# Altium project rovi_tracking.PrjPcb
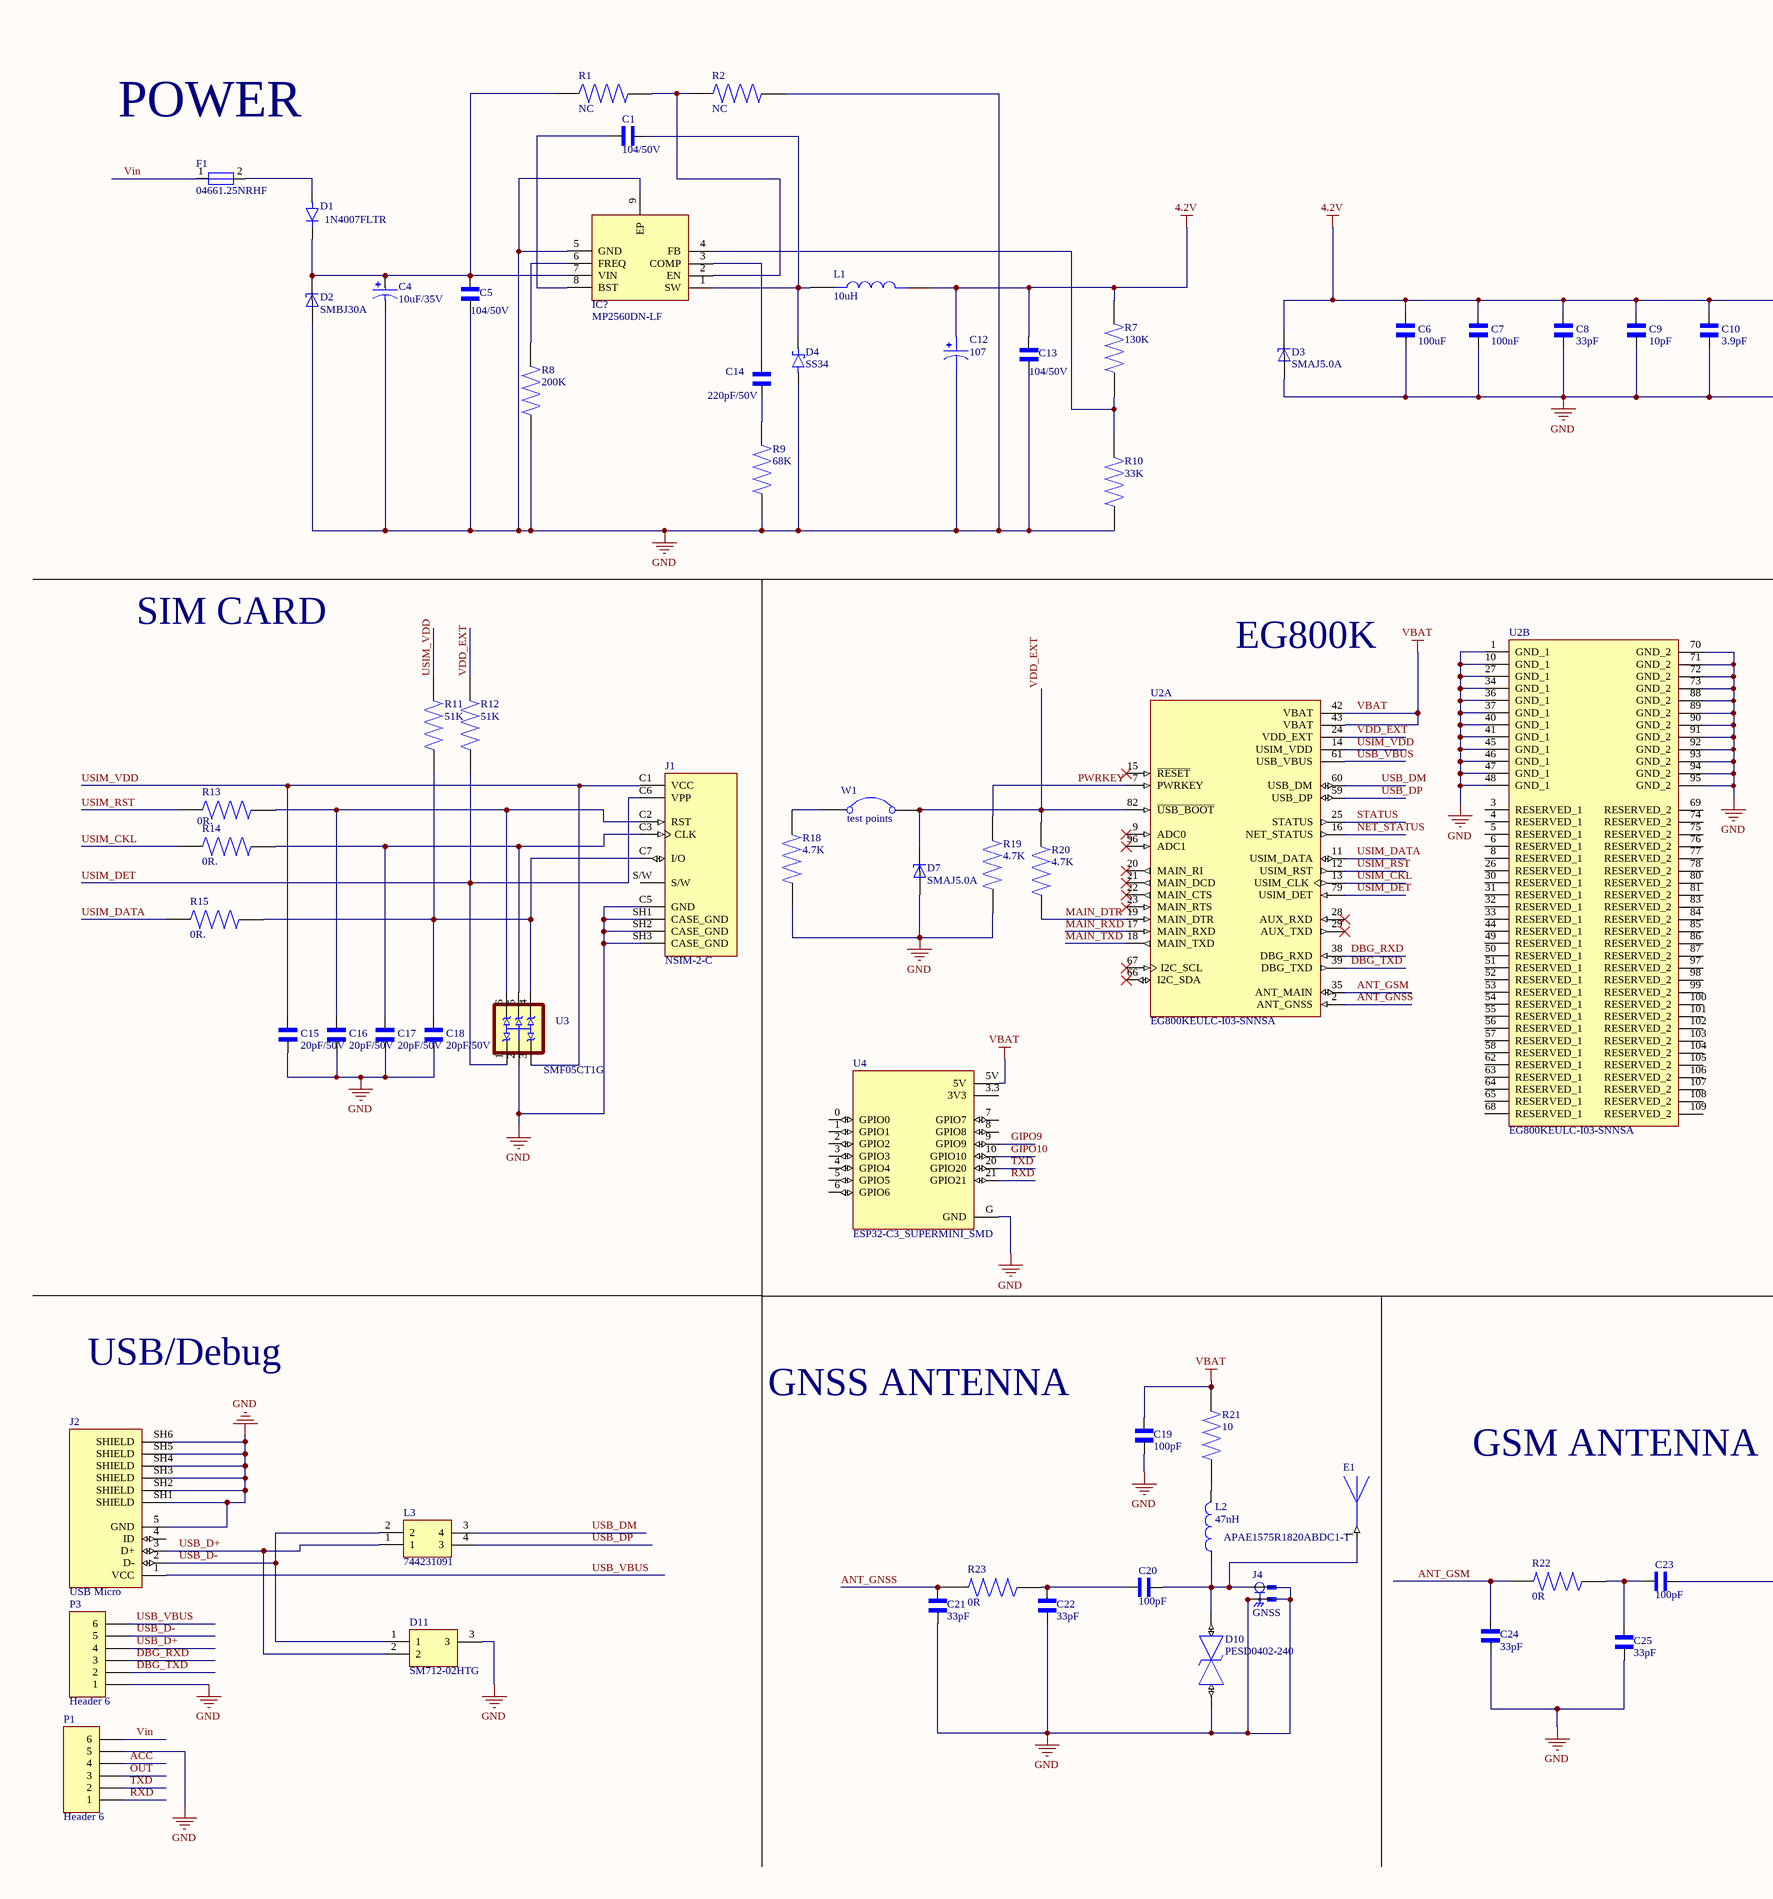
[diagram p0: EG800K.SchDoc, left]
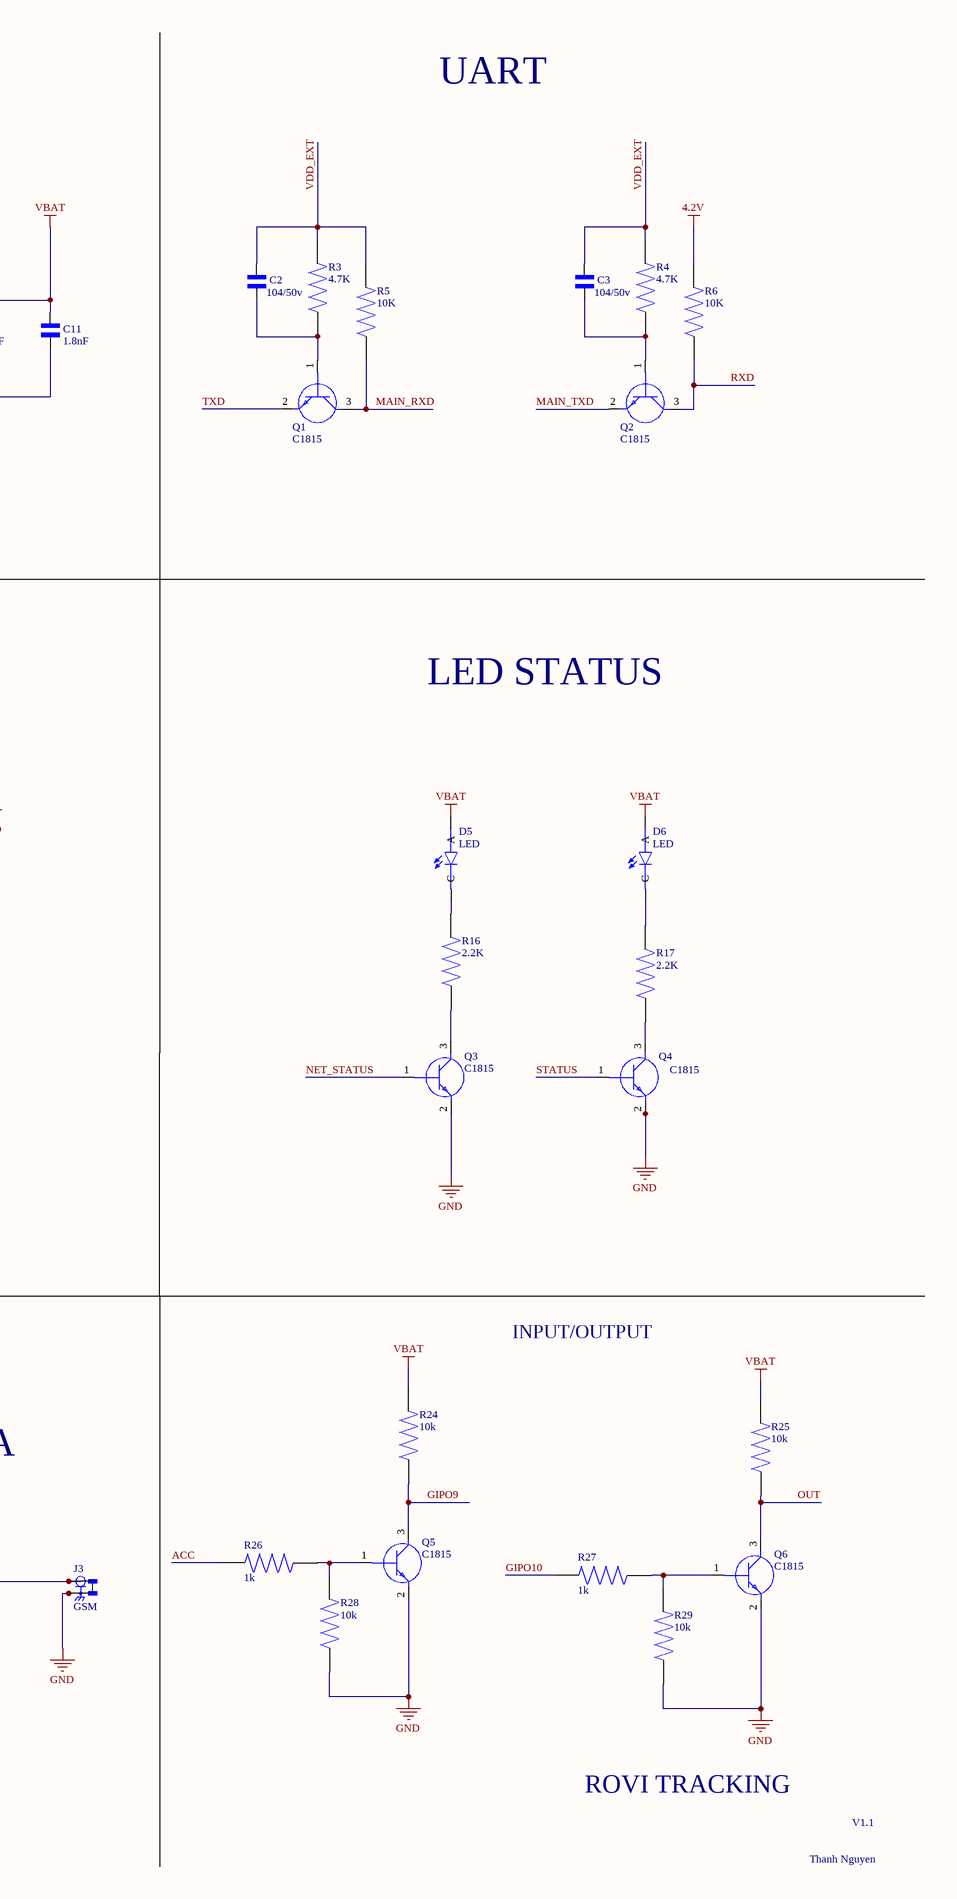
[diagram p1: EG800K.SchDoc, right]
1 sheet, 85 parts. Net scope: global (net labels, ports and power ports of the same name join across sheets).
Board file: PCB1.PcbDoc

## Sheet EG800K.SchDoc: ROVI TRACKING
size A2; CompanyName: ROVI_GPS; DrawnBy: Thanh_Nguyen; Engineer: Thanh_Nguyen; SheetNumber: 1; SheetTotal: 1

### Parts
C1  104/50V  [CAPC2012X140N]
C2  104/50v  [CAPC2012X140N]
C3  104/50v  [CAPC2012X140N]
C4  10uF/35V  [CAP_EEEFN1J100L]
C5  104/50V  [CAPC2012X140N]
C6  100uF  [CAPC2012X140N]
C7  100nF  [CAPC2012X140N]
C8  33pF  [CAPC2012X140N]
C9  10pF  [CAPC2012X140N]
C10  3.9pF  [CAPC2012X140N]
C11  1.8nF  [CAPC2012X140N]
C12  107  [CAPMP7343X310N]
C13  104/50V  [CAPC2012X140N]
C14  220pF/50V  [CAPC2012X140N]
C15  20pF/50V  [CAPC2012X140N]
C16  20pF/50V  [CAPC2012X140N]
C17  20pF/50V  [CAPC2012X140N]
C18  20pF/50V  [CAPC2012X140N]
C19  100pF  [CAPC2012X140N]
C20  100pF  [CAPC2012X140N]
C21  33pF  [CAPC2012X140N]
C22  33pF  [CAPC2012X140N]
C23  100pF  [CAPC2012X140N]
C24  33pF  [CAPC2012X140N]
C25  33pF  [CAPC2012X140N]
D1  1N4007FLTR  [SODFL3618X110N]
D2  SMBJ30A  [DIOM4336X265N]
D3  SMAJ5.0A  [DIOM4325X250N]
D4  SS34  [DIOM7959X265N]
D5  LED  [LEDC2012X70N]
D6  LED  [LEDC2012X70N]
D7  SMAJ5.0A  [DIOM4325X250N]
D10  PESD0402-240  [DIONC1005X43N]
D11  SM712-02HTG  [SM71202HTG]
E1  APAE1575R1820ABDC1-T  [XDCR_APAE1575R1820ABDC1-T]
F1  04661.25NRHF  [FUSC3115X66N]
IC?  MP2560DN-LF  [SOIC127P600X170-9N]
J1  NSIM-2-C  [CUI_NSIM-2-C]
J2  USB Micro  [AMPHENOL_10118194-0001LF]
J3  GSM  [TE_CONMHF4-SMD-G-T]
J4  GNSS  [TE_CONMHF4-SMD-G-T]
L1  10uH  [IND_LQH66SN100M03L]
L2  47nH  [INDC1608X95N]
L3  744231091  [WE-CNSW_08058]
P1  Header 6  [HDR1X6]
P3  Header 6  [HDR1X6]
Q1  C1815  [SOT95P240X110-3N]
Q2  C1815  [SOT95P240X110-3N]
Q3  C1815  [SOT95P240X110-3N]
Q4  C1815  [SOT95P240X110-3N]
Q5  C1815  [SOT95P240X110-3N]
Q6  C1815  [SOT95P240X110-3N]
R1  NC  [RESC2012X65N]
R2  NC  [RESC2012X65N]
R3  4.7K  [RESC2012X65N]
R4  4.7K  [RESC2012X65N]
R5  10K  [RESC2012X65N]
R6  10K  [RESC2012X65N]
R7  130K  [RESC2012X65N]
R8  200K  [RESC2012X65N]
R9  68K  [RESC2012X65N]
R10  33K  [RESC2012X65N]
R11  51K  [RESC2012X65N]
R12  51K  [RESC2012X65N]
R13  0R.  [RESC2012X65N]
R14  0R.  [RESC2012X65N]
R15  0R.  [RESC2012X65N]
R16  2.2K  [RESC2012X65N]
R17  2.2K  [RESC2012X65N]
R18  4.7K  [RESC2012X65N]
R19  4.7K  [RESC2012X65N]
R20  4.7K  [RESC2012X65N]
R21  10  [RESC2012X65N]
R22  0R  [RESC2012X65N]
R23  0R  [RESC2012X65N]
R24  10k  [RESC2012X65N]
R25  10k  [RESC2012X65N]
R26  1k  [RESC2012X65N]
R27  1k  [RESC2012X65N]
R28  10k  [RESC2012X65N]
R29  10k  [RESC2012X65N]
U2  EG800KEULC-I03-SNNSA  [XCVR_EG800KEULC-I03-SNNSA]  (parts A,B of 2)
U3  SMF05CT1G  [SOT65P210X110-6N]
U4  ESP32-C3_SUPERMINI_SMD  [MODULE_ESP32-C3_SUPERMINI]
W1  test points  [KEYSTONE_5102]

### Nets
GND: C4.2 C5.1 C6.1 C7.1 C8.1 C9.1 C10.1 C11.1 C12.2 C13.1 C15.1 C16.1 C17.1 C18.1 C19.2 C21.1 C22.1 C24.2 C25.2 D2.A D3.A D4.A D7.A D10.1 D11.3 IC?.5(GND) IC?.9(EP) J1.C5(GND) J1.SH1(CASE_GND) J1.SH2(CASE_GND) J1.SH3(CASE_GND) J2.5(GND) J2.SH1(SHIELD) J2.SH2(SHIELD) J2.SH3(SHIELD) J2.SH4(SHIELD) J2.SH5(SHIELD) J2.SH6(SHIELD) J3.2(GND) J3.3(GND) J3.4(GND) J4.2(GND) J4.3(GND) J4.4(GND) P1.5 P3.1 Q3.2(E) Q4.2(E) Q5.2(E) Q6.2(E) R2.2 R8.1 R9.1 R10.1 R18.2 R19.2 R28.1 R29.1 U2.1(GND_1) U2.10(GND_1) U2.27(GND_1) U2.34(GND_1) U2.36(GND_1) U2.37(GND_1) U2.40(GND_1) U2.41(GND_1) U2.45(GND_1) U2.46(GND_1) U2.47(GND_1) U2.48(GND_1) U2.70(GND_2) U2.71(GND_2) U2.72(GND_2) U2.73(GND_2) U2.88(GND_2) U2.89(GND_2) U2.90(GND_2) U2.91(GND_2) U2.92(GND_2) U2.93(GND_2) U2.94(GND_2) U2.95(GND_2) U3.2(A) U4.G(GND)
VBAT: C6.2 C7.2 C8.2 C9.2 C10.2 C11.2 C12.1 C13.2 C19.1 D3.C D5.A D6.A L1.2 R6.2 R7.2 R21.2 R24.2 R25.2 U2.42(VBAT) U2.43(VBAT) U4.5V  [also labelled 4.2V]
ACC: P1.4 R26.2
ANT_GNSS: C21.2 R23.2 U2.2(ANT_GNSS)
ANT_GSM: C24.1 R22.2 U2.35(ANT_MAIN)
DBG_RXD: P3.3 U2.38(DBG_RXD)
DBG_TXD: P3.2 U2.39(DBG_TXD)
GIPO9: Q5.3(C) R24.1 U4.9(GPIO9)
GIPO10: R27.2 U4.10(GPIO10)
MAIN_DTR: R20.2 U2.19(MAIN_DTR)
MAIN_RXD: Q1.3(C) R5.1 U2.17(MAIN_RXD)
MAIN_TXD: Q2.2(E) U2.18(MAIN_TXD)
NET_STATUS: Q3.1(B) U2.16(NET_STATUS)
OUT: P1.3 Q6.3(C) R25.1
PWRKEY: R19.1 U2.7(PWRKEY)
RXD: P1.1 Q2.3(C) R6.1 U4.21(GPIO21)
STATUS: Q4.1(B) U2.25(STATUS)
TXD: P1.2 Q1.2(E) U4.20(GPIO20)
USB_D+: D11.2 J2.3(D+) L3.1 P3.4
USB_D-: D11.1 J2.2(D-) L3.2 P3.5
USB_DM: L3.3(4) U2.60(USB_DM)
USB_DP: L3.4(3) U2.59(USB_DP)
USB_VBUS: J2.1(VCC) P3.6 U2.61(USB_VBUS)
USIM_CKL: R14.1 U2.13(USIM_CLK)
USIM_DATA: R15.1 U2.11(USIM_DATA)
USIM_DET: J1.C6(VPP) R12.2 U2.79(USIM_DET) U3.1(C1)
USIM_RST: R13.1 U2.12(USIM_RST)
USIM_VDD: C15.2 J1.C1(VCC) R11.1 U2.14(USIM_VDD) U3.3(C2)
VDD_EXT: C2.2 C3.2 D7.C R3.2 R4.2 R5.2 R12.1 R20.1 U2.24(VDD_EXT) U2.82(~{USB_BOOT}) W1.2
Vin: F1.1 P1.6
NetC1_1: C1.1 D4.C(K) IC?.1(SW) L1.1
NetC1_2: C1.2 IC?.8(BST)
NetC2_1: C2.1 Q1.1(B) R3.1
NetC3_1: C3.1 Q2.1(B) R4.1
NetC4_1: C4.1 C5.2 D1.1(K) D2.C IC?.7(VIN) R1.1
NetC14_1: C14.1 R9.2
NetC14_2: C14.2 IC?.3(COMP)
NetC16_2: C16.2 J1.C2(RST) R13.2 U3.6(C5)
NetC17_2: C17.2 J1.C3(CLK) R14.2 U3.5(C4)
NetC18_2: C18.2 J1.C7(I/O) R11.2 R15.2 U3.4(C3)
NetC20_1: C20.1 D10.2 E1.1 J4.1(SIG) L2.1
NetC20_2: C20.2 C22.2 R23.1
NetC23_1: C23.1 J3.1(SIG)
NetC23_2: C23.2 C25.1 R22.1
NetD1_2: D1.2(A) F1.2
NetD5_C: D5.C R16.2
NetD6_C: D6.C R17.2
NetIC?_2: IC?.2(EN) R1.2 R2.1
NetIC?_4: IC?.4(FB) R7.1 R10.2
NetIC?_6: IC?.6(FREQ) R8.2
NetL2_2: L2.2 R21.1
NetQ3_3: Q3.3(C) R16.1
NetQ4_3: Q4.3(C) R17.1
NetQ5_1: Q5.1(B) R26.1 R28.2
NetQ6_1: Q6.1(B) R27.1 R29.2
NetR18_1: R18.1 W1.1

Not connected (* = marked no-connect by the designer): J1 S/W; J2 4(ID); U2 3(RESERVED_1) 4(RESERVED_1) 5(RESERVED_1) 6(RESERVED_1) 8(RESERVED_1) 9(ADC0)* 15(~{RESET})* 20(MAIN_RI)* 21(MAIN_DCD)* 22(MAIN_CTS)* 23(MAIN_RTS)* 26(RESERVED_1) 28(AUX_RXD)* 29(AUX_TXD)* 30(RESERVED_1) 31(RESERVED_1) 32(RESERVED_1) 33(RESERVED_1) 44(RESERVED_1) 49(RESERVED_1) 50(RESERVED_1) 51(RESERVED_1) 52(RESERVED_1) 53(RESERVED_1) 54(RESERVED_1) 55(RESERVED_1) 56(RESERVED_1) 57(RESERVED_1) 58(RESERVED_1) 62(RESERVED_1) 63(RESERVED_1) 64(RESERVED_1) 65(RESERVED_1) 66(I2C_SDA)* 67(I2C_SCL)* 68(RESERVED_1) 69(RESERVED_2) 74(RESERVED_2) 75(RESERVED_2) 76(RESERVED_2) 77(RESERVED_2) 78(RESERVED_2) 80(RESERVED_2) 81(RESERVED_2) 83(RESERVED_2) 84(RESERVED_2) 85(RESERVED_2) 86(RESERVED_2) 87(RESERVED_2) 96(ADC1)* 97(RESERVED_2) 98(RESERVED_2) 99(RESERVED_2) 100(RESERVED_2) 101(RESERVED_2) 102(RESERVED_2) 103(RESERVED_2) 104(RESERVED_2) 105(RESERVED_2) 106(RESERVED_2) 107(RESERVED_2) 108(RESERVED_2) 109(RESERVED_2); U4 0(GPIO0) 1(GPIO1) 2(GPIO2) 3(GPIO3) 3.3(3V3) 4(GPIO4) 5(GPIO5) 6(GPIO6) 7(GPIO7) 8(GPIO8)

### Notes on the sheet
- UART
- POWER
- SIM CARD
- EG800K
- LED STATUS
- USB/Debug
- INPUT/OUTPUT
- GNSS ANTENNA
- GSM ANTENNA
- ROVI TRACKING
- Thanh Nguyen
- V1.1

### Library data of the parts
C1-C3 C5 C13 = CL21A226MQQNNNG: Capacitors 104 100nF 0805 50V 10%; MF: {'manufacturer': u'Samsung Electro-Mechanics'}; Package: None; Price: None; Value: *; MP: CL21A226MQQNNNG; Availability: Unavailable
C4 = EEEFN1J100L: luminum Electrolytic Capacitors - SMD 63VDC 10uF 20% 6.3x5.8mm AEC-Q200; MF: {'manufacturer': u'Panasonic'}; Package: None; Price: None; Value: *; MP: EEEFN1J100L; Availability: Unavailable
C6-C8 C10 C11 C15-C22 = CL21A226MQQNNNG: Capacitors 0805; MF: {'manufacturer': u'Samsung Electro-Mechanics'}; Package: None; Price: None; Value: *; MP: CL21A226MQQNNNG; Availability: Unavailable
C9 = CL21A226MQQNNNG: Capacitors 0805 50V 10%; MF: {'manufacturer': u'Samsung Electro-Mechanics'}; Package: None; Price: None; Value: *; MP: CL21A226MQQNNNG; Availability: Unavailable
C12 = TAJD107K016RNJV: Tantalum Capacitors - Solid SMD 16V 100uF 2917 ESR=6 00mOhms 10%; MF: {'manufacturer': u'AVX'}; Package: None; Price: None; Value: *; MP: TAJD107K016RNJV; Availability: Unavailable
C14 = CL21A226MQQNNNG: Capacitors 220pF 0805 50V 10%; MF: {'manufacturer': u'Samsung Electro-Mechanics'}; Package: None; Price: None; Value: *; MP: CL21A226MQQNNNG; Availability: Unavailable
C23-C25 = CL21A226MQQNNNG: MF: {'manufacturer': u'Samsung Electro-Mechanics'}; Package: None; Price: None; Value: *; MP: CL21A226MQQNNNG; Availability: Unavailable
D1 = 1N4007FLTR: 1N4007FLTR STANDARD RECTIFIER 1000V SOD-123; MF: {'manufacturer': u'SMC Diode Solutions'}; Package: None; Price: None; Value: *; MP: 1N4007FLTR; Availability: Unavailable
D2 = SMBJ30A: MF: {'manufacturer': u'STMicroelectronics'}; Package: None; Price: None; Value: *; MP: SMBJ30A; Availability: Unavailable
D3 = SMAJ5.0A: SMAJ5.0A TVS DIODE 5VWM 9.2VC SMA(DO-214AC); MF: {'manufacturer': u'Taiwan Semiconductor'}; Package: None; Price: None; Value: *; MP: SMAJ5.0A; Availability: Unavailable
D4 = SS34: SS34 Diode Schottky 3A 40V SMA(DO-214AC); MF: {'manufacturer': u'onsemi'}; Package: None; Price: None; Value: *; MP: SS34; Availability: Unavailable
D5 D6 = 597-3305-607F: MF: {'manufacturer': u'Dialight'}; Package: None; Price: None; Value: *; MP: 597-3305-607F; Availability: Unavailable
D7 = SMAJ5.0A: MF: {'manufacturer': u'Taiwan Semiconductor'}; Package: None; Price: None; Value: *; MP: SMAJ5.0A; Availability: Unavailable
D10 = PESD0402-240: Polymer ESD PESD line of devices; MF: Littelfuse; SnapEDA_Link: https://www.snapeda.com/parts/PESD0402-240/Ersa/view-part/?ref=snap; Package: None; Value: *; MP: PESD0402-240; Check_prices: https://www.snapeda.com/parts/PESD0402-240/Ersa/view-part/?ref=eda
D11 = SM712-02HTG: TVS Diode (Bi-directional); Manufacturer_Name: LITTELFUSE; Datasheet Link: https://www.littelfuse.com/media?resourcetype=datasheets&itemid=a4019802-ff62-41ff-bf66-295f97422f81&filename=littelfuse-tvs-diode-array-sm712-datasheet; Height: 1.12mm; Manufacturer_Part_Number: SM712-02HTG; Mouser Part Number: 576-SM712-02HTG; Mouser Price/Stock: https://www.mouser.co.uk/ProductDetail/Littelfuse/SM712-02HTG?qs=aGgfWYEhH7lQgBVBPCUDkw%3D%3D; Arrow Part Number: SM712-02HTG; Arrow Price/Stock: https://www.arrow.com/en/products/sm712-02htg/littelfuse?utm_currency=USD&region=nac
E1 = APAE1575R1820ABDC1-T: MF: {'manufacturer': u'Abracon'}; Package: None; Price: None; Value: *; MP: APAE1575R1820ABDC1-T; Availability: Unavailable
F1 = 04661.25NRHF: Surface Mount Fuses 63V 1.25A FA SLIM; MF: {'manufacturer': u'Littelfuse'}; Package: None; Price: None; Value: *; MP: 04661.25NRHF; Availability: Unavailable
IC? = MP2560DN-LF: Integrated Circuit; Manufacturer_Name: Monolithic Power Systems (MPS); Datasheet Link: http://www.monolithicpower.com/DesktopModules/DocumentManage/API/Document/getDocument?id=1798; Height: 1.7mm; Manufacturer_Part_Number: MP2560DN-LF; Mouser Part Number: 946-MP2560DNLF; Mouser Price/Stock: https://www.mouser.co.uk/ProductDetail/Monolithic-Power-Systems-MPS/MP2560DN-LF?qs=rC7bBWoQAAleyiym%2FnQvhQ%3D%3D
J1 = NSIM-2-C: MF: {'manufacturer': u'Same Sky'}; Package: None; Price: None; Value: *; MP: NSIM-2-C; Availability: Unavailable
J2 = 10118194-0001LF: MF: {'manufacturer': u'Amphenol ICC (FCI)'}; Package: None; Price: None; Value: *; MP: 10118194-0001LF; Availability: Unavailable
J3 J4 = CONMHF4-SMD-G-T: MF: {'manufacturer': u'Linx Technologies Inc.'}; Package: None; Price: None; Value: *; MP: CONMHF4-SMD-G-T; Availability: Unavailable
L1 = LQH66SN100M03L: RF Inductors - SMD 10 UH 20%; MF: {'manufacturer': u'Murata'}; Package: None; Price: None; Value: *; MP: LQH66SN100M03L; Availability: Unavailable
L2 = LQG18HH47NJ00D: MF: {'manufacturer': u'Murata Electronics'}; Package: None; Price: None; Value: *; MP: LQG18HH47NJ00D; Availability: Unavailable
L3 = 744231091: Inductor; Manufacturer_Name: Wurth Elektronik; Datasheet Link: http://componentsearchengine.com/Datasheets/1/744231091.pdf; Manufacturer_Part_Number: 744231091; Mouser Part Number: 710-744231091; Mouser Price/Stock: https://www.mouser.co.uk/ProductDetail/Wurth-Elektronik/744231091?qs=PGXP4M47uW7beLYOUbZm8Q%3D%3D
P1 P3 = Header 6: Header, 6-Pin; LatestRevisionDate: 17-Jul-2002; LatestRevisionNote: Re-released for DXP Platform.; Publisher: Altium Limited
Q1-Q6 = C1815: Transistor BJT NPN; Manufacturer_Name: Rectron; Datasheet Link: https://4donline.ihs.com/images/VipMasterIC/IC/RECT/RECTS01160/RECTS01160-1.pdf?hkey=EF798316E3902B6ED9A73243A3159BB0; Height: 1.1mm; Manufacturer_Part_Number: C1815
R1-R29 = MCR10EZHJ103: Resistor 0808; MF: {'manufacturer': u'Rohm'}; Package: None; Price: None; Value: *; MP: MCR10EZHJ103; Availability: Unavailable
U2 = EG800KEULC-I03-SNNSA: Quectel Wireless Solutions LTE Cat 1.bis, w/o GNSS & BT, w/o VoLTE, w/ DFOTA. Wi-Fi scan, USB 2.0 interface; SnapEDA_Link: https://www.snapeda.com/parts/EG800KEULC-I03-SNNSA/Quectel/view-part/?ref=snap; Package: None; Value: *; MF: Quectel; MP: EG800KEULC-I03-SNNSA; Check_prices: https://www.snapeda.com/parts/EG800KEULC-I03-SNNSA/Quectel/view-part/?ref=eda
U3 = SMF05CT1G: MF: {'manufacturer': u'ON Semiconductor'}; Package: None; Price: None; Value: *; MP: SMF05CT1G; Availability: Unavailable
U4 = ESP32-C3_SUPERMINI_SMD: MF: {'manufacturer': u'Espressif Systems'}; Package: None; Price: None; Value: *; MP: ESP32-C3_SUPERMINI_SMD; Availability: Unavailable
W1 = 5102: MF: {'manufacturer': u'Keystone'}; Package: None; Price: None; Value: *; MP: 5102; Availability: Unavailable